# Altium schematic sheet 03_USB.SchDoc
size A3
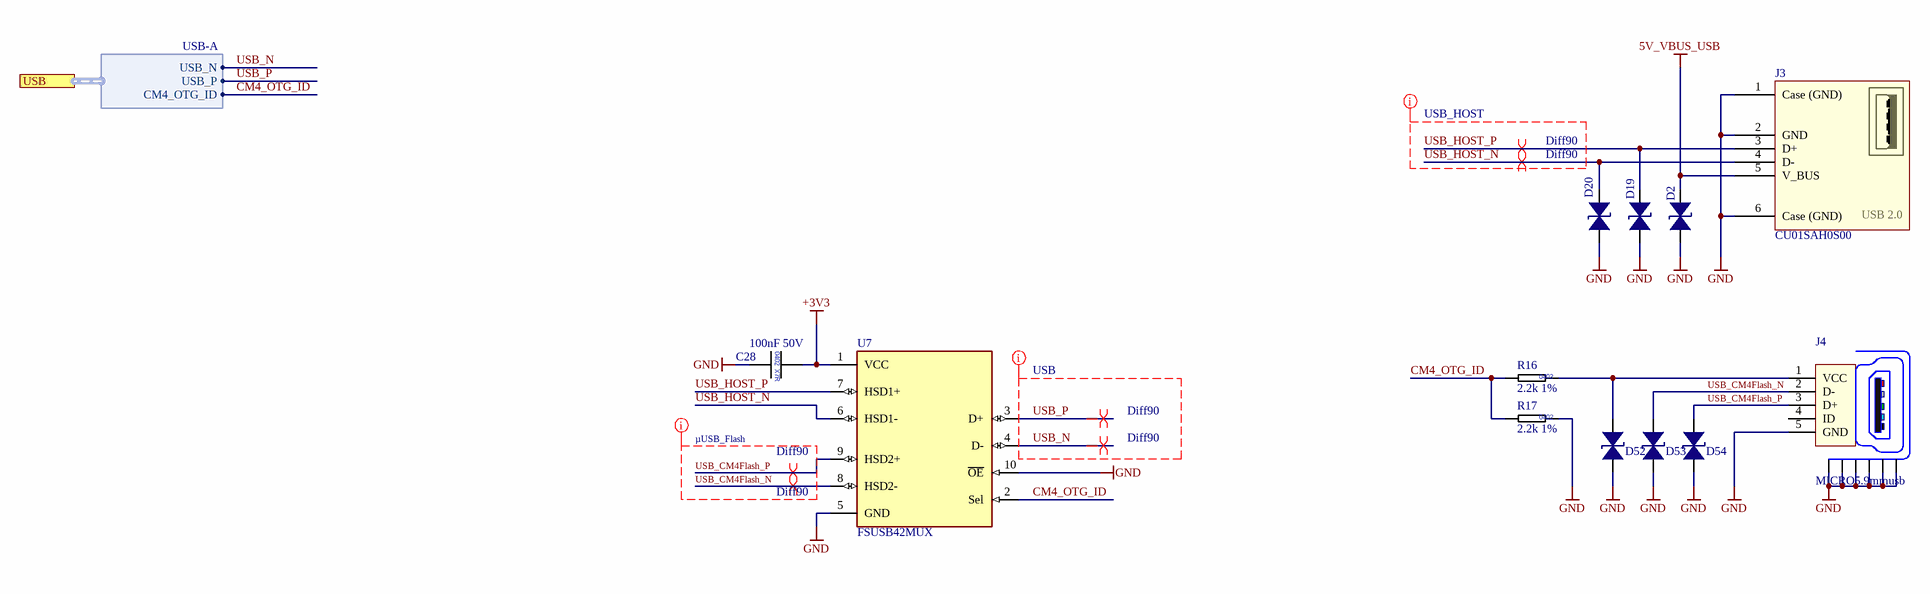
[diagram p0: 03_USB.SchDoc]

## Parts
C28  100nF 50V  [CAP_0402_L]
D2  CESDP0402UC5VB  [TVS_0402]  (value not drawn)
D19  CESDP0402UC5VB  [TVS_0402]  (value not drawn)
D20  CESDP0402UC5VB  [TVS_0402]  (value not drawn)
D52  CESDP0402UC5VB  [TVS_0402]  (value not drawn)
D53  CESDP0402UC5VB  [TVS_0402]  (value not drawn)
D54  CESDP0402UC5VB  [TVS_0402]  (value not drawn)
J3  CU01SAH0S00  [USB_A_2.0_single]
J4  MICRO5.9mmusb  [MICRO5.9mmusb]
R16  2.2k 1%  [RES_0402_L]
R17  2.2k 1%  [RES_0402_L]
U7  FSUSB42MUX  [SOP50P300X300X110-10N]

## Ports
USB (harness USB-A)

## Harnesses
USB-A: USB_N, USB_P, CM4_OTG_ID

## Nets
5V_VBUS_USB: D2.1 J3.5(V_BUS)
+3V3: C28.1 U7.1(VCC)
GND: C28.2 D2.2 D19.2 D20.2 D52.2 D53.2 D54.2 J3.1(Case_(GND)) J3.2(GND) J3.6(Case_(GND)) J4.5(GND) J4.6(Shield) J4.7(Shield) J4.8(Shield) J4.9(Shield) J4.10(Shield) J4.11(Shield) R17.1 U7.5(GND) U7.10(~{OE})
CM4_OTG_ID: R16.2 R17.2 U7.2(Sel) ; port USB.CM4_OTG_ID
USB_CM4Flash_N: D53.1 J4.2(D-) U7.8(HSD2-)
USB_CM4Flash_P: D54.1 J4.3(D+) U7.9(HSD2+)
USB_HOST_N: D20.1 J3.4(D-) U7.6(HSD1-)
USB_HOST_P: D19.1 J3.3(D+) U7.7(HSD1+)
USB_N: U7.4(D-) ; port USB.USB_N
USB_P: U7.3(D+) ; port USB.USB_P
NetD52_1: D52.1 J4.1(VCC) R16.1

Not connected (* = marked no-connect by the designer): J4 4(ID)

## Layout directives
net class USB_HOST: USB_HOST_N, USB_HOST_P
differential pair; net class Diff90; DiffPairClass: Diff90: USB_HOST_P, USB_P
differential pair; net class Diff90: USB_CM4Flash_N, USB_CM4Flash_P, USB_HOST_N, USB_N
net class µUSB_Flash: USB_CM4Flash_N, USB_CM4Flash_P
net class USB: USB_N, USB_P

## Notes on the sheet
- Title:
- ++CONFIDENTIAL++
- Date:
- Sheet:
- /
- Time:
- Engineer
- Elektronik- und Softwareentwicklung aus Nürnberg
- The  information  contained  in  these  documents  is  confidential,  privileged  and  only  for  the
  information of the intended recipient and may
  not be used, published or redistributed without
  the prior written consent from PCB Arts GmbH.
- Revision:
- Checked:
- https://pcb-arts.com/
- mail@pcb-arts.com
- (in symbol CAP_0402_100nF_50V) 0402; X7R
- (in symbol RES_0402_2.2k_1%) 0402
- (in symbol USBA_single) USB 2.0

## Library data of the parts
C28 = CAP_0402_100nF_50V: Multilayer Ceramic Capacitors MLCC - SMD/SMT 0402 50VDC; Manufacturer 1: Murata Electronics; Manufacturer 1 Prt. Nr.: GCM155L8EH104KE07D; Manufacturer 2 Prt. Nr.: UMK105B7104KV-FR; Manufacturer 2: TDK
D2 D19 D20 D52-D54 = CESDP0402UC5VB_TVS Diode 0402: Low Capacitance ESD Protection Diode 0402; Manufacturer 1: CREATEK; Manufacturer 2 Prt. Nr.: BPESD0402-05ST; Manufacturer 1 Prt. Nr.: CESDP0402UC5VB; Manufacturer 2: BORN
J3 = USBA_single: USB-A USB 2.0 Buchse Steckverbinder, rechtwinklig; Manufacturer 1: Cvilux USA; Manufacturer 1 Prt. Nr.: CU01SAH0S00
J4 = SMD micro USB Connector Horizontal C393940: SHOU HAN  MICRO5.9mmusb; Manufacturer 1: SHOU HAN; Manufacturer 1 Prt. Nr.: MICRO5.9mmusb
R16 R17 = RES_0402_2.2k_1%: Thick Film Resistors - SMD 2.2kOhm 1%; Manufacturer 1: Vishay / Dale; Manufacturer 1 Prt. Nr.: CRCW04022K20FKEDC; Manufacturer 2 Prt. Nr.: AF0402FR-072K2L; Manufacturer 2: Yageo
U7 = FSUSB42MUX_IC USB SWITCH DPDT: IC USB SWITCH DPDT; Manufacturer 1: onsemi / Fairchild; Manufacturer 1 Prt. Nr.: FSUSB42MUX